# EasyEDA Pro project FKM3.epro, schematic Schematic1

## Sheets
1 P1: Board Name: AttendanceMonitor; Create Date: 2025-02-05; Page Name: P1; Project Name: fkm3; Schematic Name: Schematic1; Update Date: 2025-02-17; Company: EasyEDA.com; Drawn: EasyEDA; Page Size: A4; Part Number: JLCPCB-002; Reviewed: EasyEDA; Version: V0.1
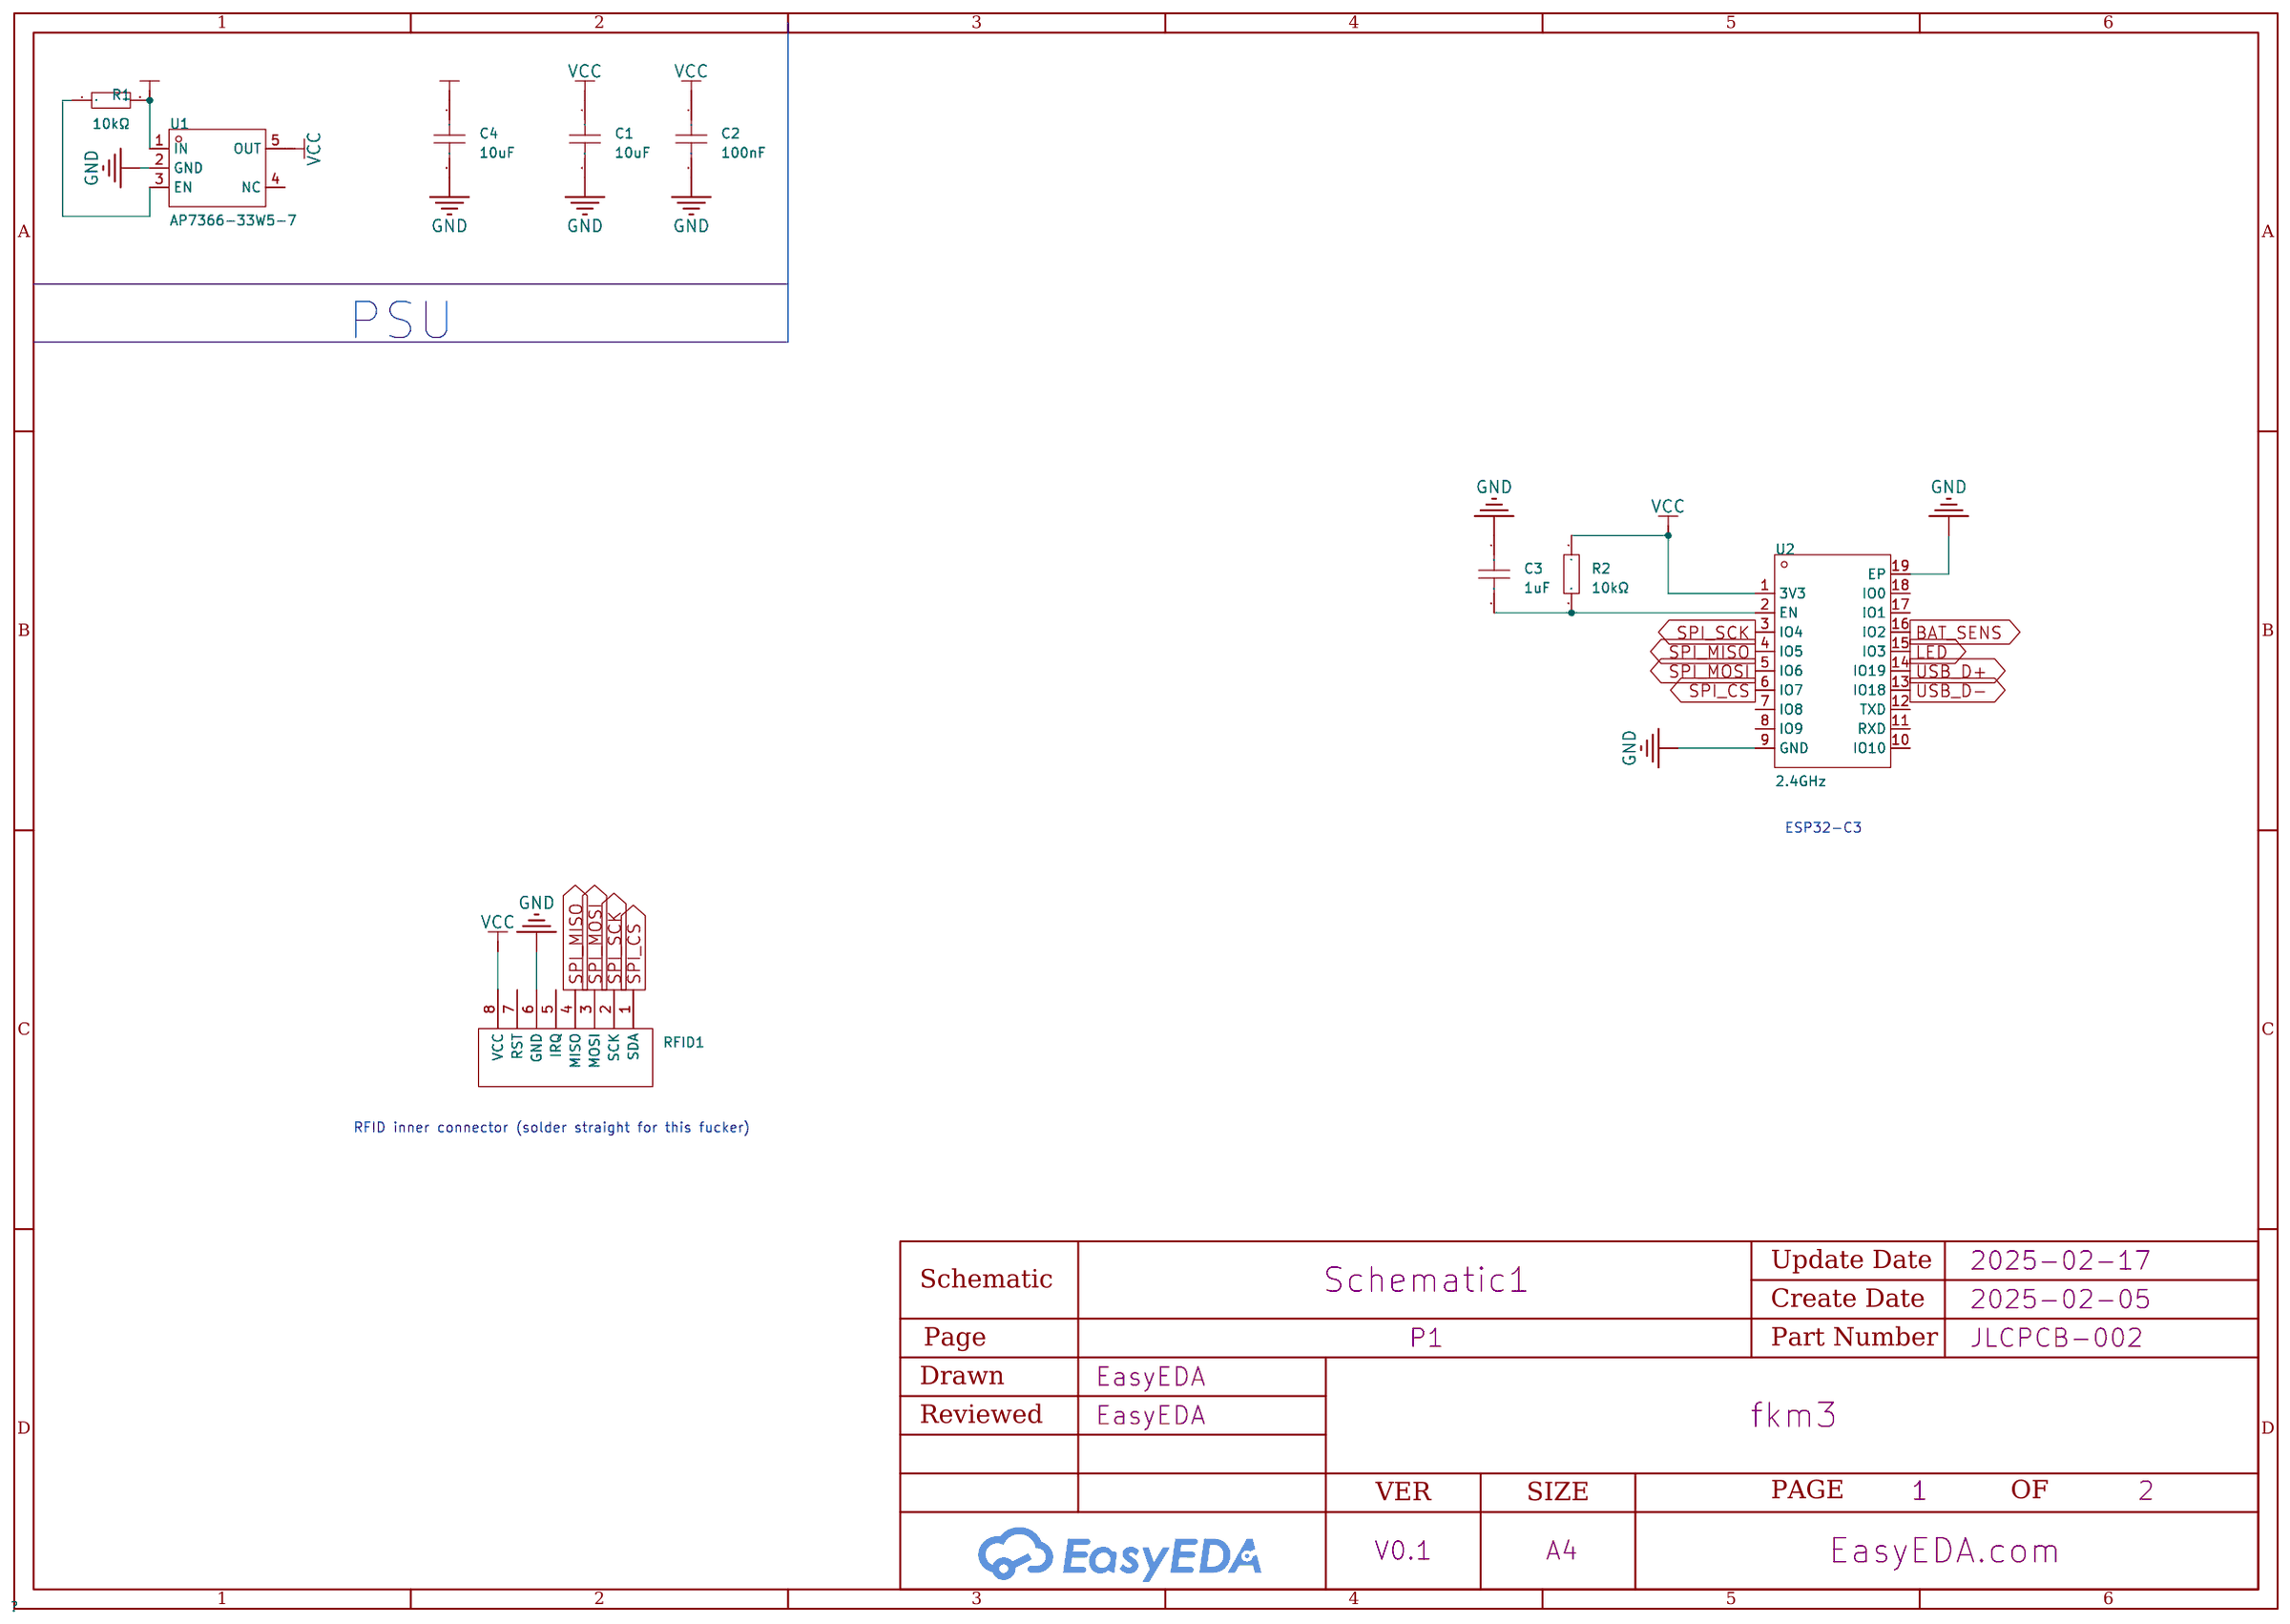
[diagram p0: P1]
2 P2: Page Name: P2; Update Date: 2025-02-07
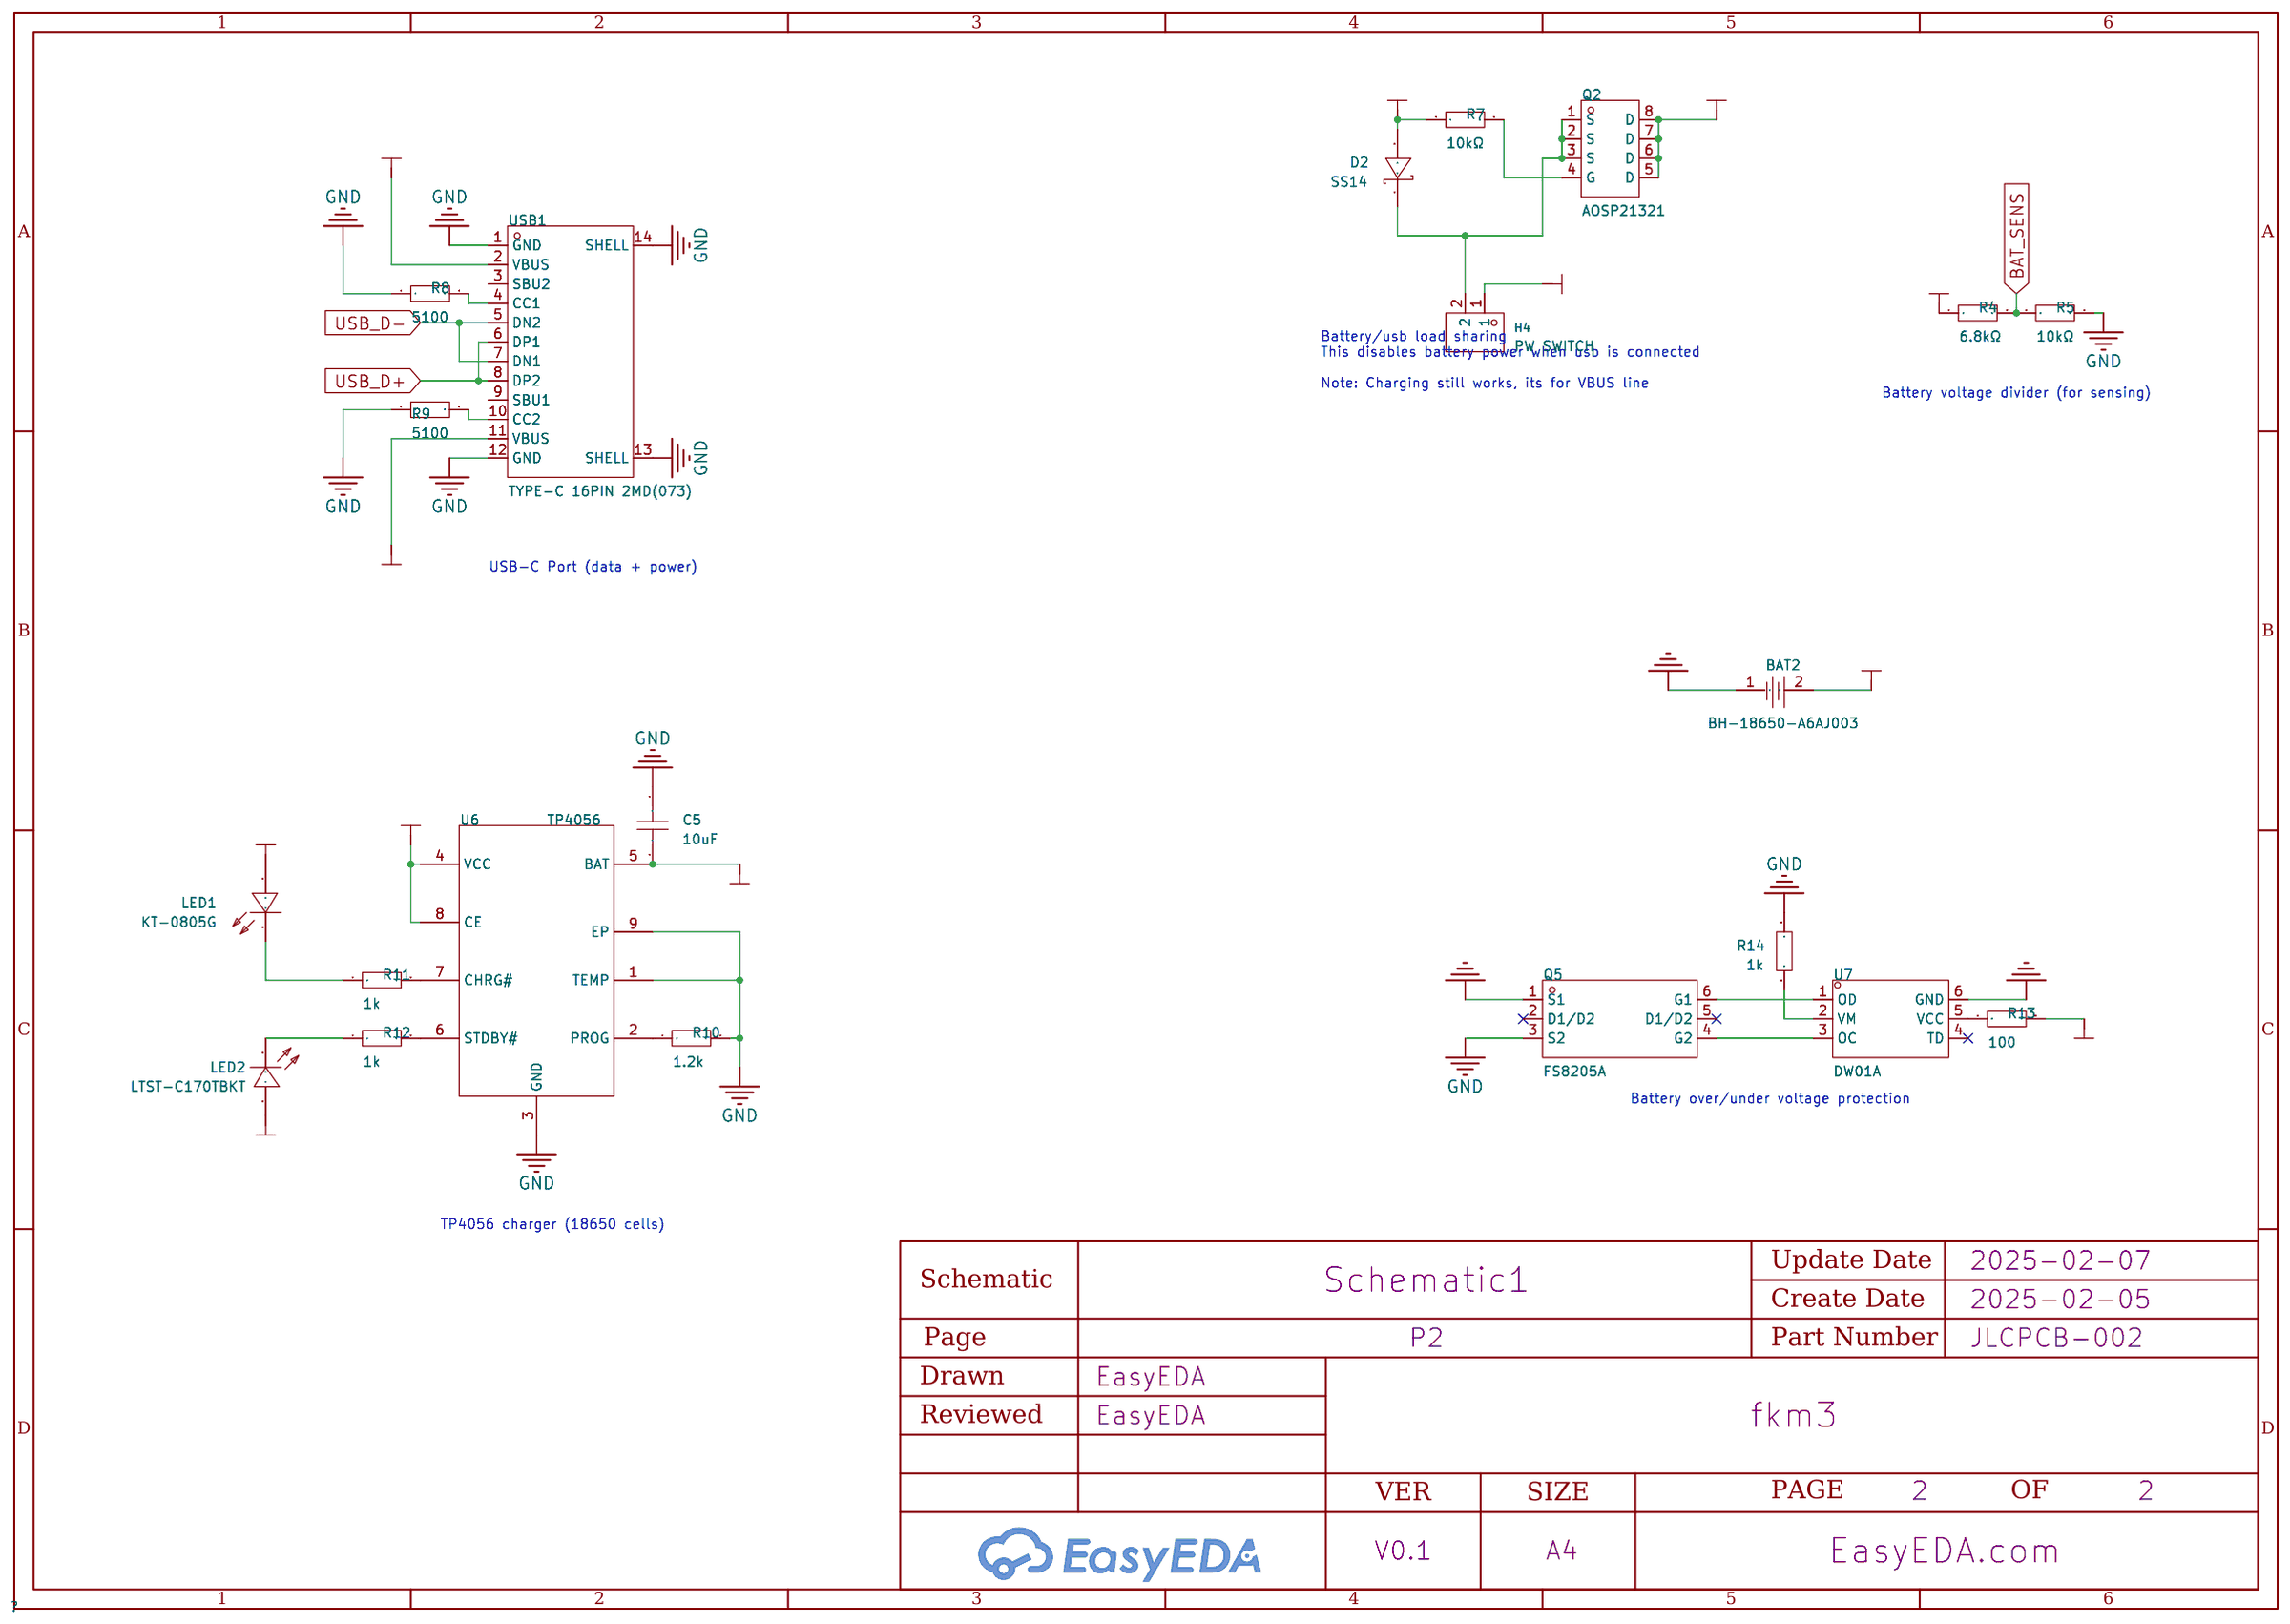
[diagram p1: P2]

## Parts
sheet P1
C1  10uF  [C0603]
C2  100nF  [C0603]
C3  1uF  [C0603]
C4  10uF  [C0603]
R1  10kΩ  [R0805]
R2  10kΩ  [R0805]
RFID1  -  [RFID-RC522-Board]
U1  AP7366-33W5-7  [SOT-25_L3.0-W1.6-P0.95-LS2.8-BL]
U2  2.4GHz  [BULETM-SMD_ESPRESSIF_ESP32-C3-WROOM-02-N4-4MB]
sheet P2
BAT2  BH-18650-A6AJ003  [BAT-TH_BH-18650-A5BJ003]
C5  10uF  [C0603]
D2  SS14  [SMA_L4.2-W2.6-LS5.3-RD]
H4  PW SWITCH  [HDR-TH_2P-P2.54-V-M]
LED1  KT-0805G  [LED0805-R-RD]
LED2  LTST-C170TBKT  [LED0805-RD_BLUE]
Q2  AOSP21321  [SOIC-8_L5.0-W4.0-P1.27-LS6.0-BL]
Q5  FS8205A  [SOT-23-6_L2.9-W1.6-P0.95-LS2.8-BR]
R4  6.8kΩ  [R0402]
R5  10kΩ  [R0805]
R7  10kΩ  [R0805]
R8  5100  [R0603]
R9  5100  [R0603]
R10  1.2k  [R0603]
R11  1k  [R0603]
R12  1k  [R0603]
R13  100  [R0603]
R14  1k  [R0603]
U6  TP4056  [ESOP-8_L4.9-W3.9-P1.27-LS6.0-BL-EP]
U7  DW01A  [SOT-23-6_L2.9-W1.6-P0.95-LS2.8-BL]
USB1  TYPE-C 16PIN 2MD(073)  [USB-C-SMD_TYPE-C-6PIN-2MD-073]

## Library data of the parts
C1 C4 = CL10A106MA8NRNC: Capacitance: Tolerance:±20% Tolerance:±20% Voltage Rated: Temperature Coefficient:; LCSC Part Name: 10uF ±20% 25V; Supplier Part: C96446; Manufacturer: SAMSUNG(三星); Supplier Footprint: 0603; JLCPCB Part Class: Basic Part; Datasheet: https://atta.szlcsc.com/upload/public/pdf/source/20160218/1457707763339.pdf; Supplier: LCSC; Tolerance: ±20%; Check: true
C2 = CC0603KRX7R9BB104: Capacitance: Tolerance:±10% Tolerance:±10% Voltage Rated: Temperature Coefficient:; LCSC Part Name: 100nF ±10% 50V; Supplier Part: C14663; Manufacturer: YAGEO(国巨); Supplier Footprint: 0603; JLCPCB Part Class: Basic Part; Datasheet: https://atta.szlcsc.com/upload/public/pdf/source/20180910/C282072_33301C7F631E79921B82A8DAC6BCC5B3.pdf; Supplier: LCSC; Tolerance: ±10%; Check: true
C3 = CL10A105KO8NNNC: Capacitance: Tolerance:±10% Tolerance:±10% Voltage Rated: Temperature Coefficient:; LCSC Part Name: 1uF ±10% 16V; Supplier Part: C1592; Manufacturer: SAMSUNG(三星); Supplier Footprint: 0603; JLCPCB Part Class: Extended Part; Datasheet: https://atta.szlcsc.com/upload/public/pdf/source/20220919/9FBE606BE0D9532D730F292EB26DC5BB.pdf; Supplier: LCSC; Tolerance: ±10%; Check: true
R1 R2 R5 R7 = SCR0805F10K: Type:Thick Film Resistors Resistance: Tolerance:±1% Tolerance:±1% Power(Watts): Overload Voltage (Max): Operating Temperature Range:-55℃~+155℃ Operating Temperature Range:-55℃~+155℃; LCSC Part Name: 厚膜电阻 10kΩ ±1% 125mW; Supplier Part: C3016734; Manufacturer: VO(翔胜); Supplier Footprint: 0805; JLCPCB Part Class: Extended Part; Datasheet: https://atta.szlcsc.com/upload/public/pdf/source/20220513/247AF9639BA21CF93567DC289CCC6A22.pdf; Supplier: LCSC; Type: Thick Film Resistors; Tolerance: ±1%; Operating Temperature Range: -55℃~+155℃; Check: true
RFID1 = RFID-RC522-Board
U1 = AP7366-33W5-7: Output Type:固定 Maximum Input Voltage:6V Output Voltage:3.3V Output Voltage:3.3V MAX Output Current:600mA Dropout Voltage:320mV@(600mA) standby current:80uA Operating Temperature:-40℃~+85℃@(Ta) Operating Temperature:-40℃~+85℃@(Ta) Output Polarity:Positive; Supplier Part: C526385; Manufacturer: DIODES(美台); Supplier Footprint: SOT-25; JLCPCB Part Class: Extended Part; Datasheet: https://atta.szlcsc.com/upload/public/pdf/source/20200515/C526385_78D268FE91AC13778CA0F1BF99E3B397.pdf; Supplier: LCSC; Output Type: 固定; Maximum Input Voltage: 6V; Output Voltage: 3.3V; MAX Output Current: 600mA; Dropout Voltage: 320mV@(600mA); standby current: 80uA; Operating Temperature: -40℃~+85℃@(Ta); Output Polarity: Positive electrode; Number of Outputs: 1
U2 = ESP32-C3-WROOM-02-N4_C2934560: Core Processor:ESP32-C3芯片 Support Interface:I2C；GPIO；SPI；JTAG；UART；USB；I2S Frequency:2.4GHz Output Power:20.5dBm Output Power:20.5dBm; LCSC Part Name: ESP32-C3-WROOM-02-N4; Supplier Part: C2934560; Manufacturer: ESPRESSIF(乐鑫); Manufacturer Part: ESP32-C3-WROOM-02-N4; Supplier Footprint: VFQFN-32-EP; JLCPCB Part Class: Extended Part; Datasheet: https://atta.szlcsc.com/upload/public/pdf/source/20220106/F07459EFFE1D7CBA94B4FB8A075146A6.pdf; Supplier: LCSC; Core Processor: ESP32-C3芯片; Support Interface: I2C；GPIO；SPI；JTAG；UART；USB；I2S; Output Power: 20.5dBm; Check: true
BAT2 = BH-18650-A6AJ003: Battery Type:- Contact Material:Stainless Steel Contact Plating:Nickel Operating Temperature Range:-25℃~+85℃ Operating Temperature Range:-25℃~+85℃; Supplier Part: C5371778; Manufacturer: MYOUNG(美阳); JLCPCB Part Class: Extended Part; Datasheet: https://atta.szlcsc.com/upload/public/pdf/source/20231218/F59CE24993943D35EA131B0A1D7CE933.pdf; Supplier: LCSC; Contact Material: Stainless Steel; Contact Plating: Nickel; Operating Temperature Range: -25℃~+85℃
C5 = CAP_0603: Supplier Footprint: 0603
D2 = SS14_C2480: Diode Configuration:Independent Type Forward Voltage (Vf@If):550mV@1A Reverse Voltage (Vr):40V Rectified Current:1A Reverse Leakage Current (Ir):300uA@40V; LCSC Part Name: 电压:40V 电流:1A; Supplier Part: C2480; Manufacturer: MDD(辰达半导体); Supplier Footprint: SMA(DO-214AC); JLCPCB Part Class: Basic Part; Datasheet: https://atta.szlcsc.com/upload/public/pdf/source/20240710/EF24798823EE33D63F154ED67BAC5E71.pdf; Supplier: LCSC; Diode Configuration: Independent Type; Forward Voltage (Vf@If): 550mV@1A; Reverse Voltage (Vr): 40V; Rectified Current: 1A; Reverse Leakage Current (Ir): 300uA@40V
H4 = PZ254V-11-02P: Pin Structure:1x2P Pitch:2.54mm Row Spacing:- Circluar Pins/Square Pins:Square Pins Mounting Type:Straight Number of Rows:Plugin Number of Pins:2P Current Rating (Max):- Voltage Rating (Max):- Length of Mating Pin:6mm Insulation Height:2.5mm Length of End; LCSC Part Name: 间距:2.54mm 1x2P 直插 方针; Supplier Part: C492401; Manufacturer: XFCN(兴飞); Supplier Footprint: 插件,P=2.54mm; JLCPCB Part Class: Extended Part; Datasheet: https://atta.szlcsc.com/upload/public/pdf/source/20200309/C492401_A812433581A9B211A7FFA413ADDFF0E5.pdf; Supplier: LCSC; Pin Structure: 1x2P; Pitch: 2.54mm; Circluar Pins/Square Pins: Square Pins; Mounting Type: Straight; Number of Rows: Plugin; Number of Pins: 2P; Length of Mating Pin: 6mm; Insulation Height: 2.5mm; Length of End Connection Pin: 3mm; Operating Temperature Range: -40℃~+105℃; Color: Black
LED1 = KT-0805G: Lamp Holder Type:- Emitted Color:Emerald Forward Voltage (VF):- Forward Voltage (VF):- Power Dissipation:- Forward Current:- Dominant Wavelength:- Dominant Wavelength:- Peak Wavelength:- Diode Configuration:- Lens Color:- Color Temperature:- Color Tempera; LCSC Part Name: 0805 翠绿 高亮; Supplier Part: C2297; Manufacturer: KENTO; Supplier Footprint: 0805; JLCPCB Part Class: Basic Part; Datasheet: https://atta.szlcsc.com/upload/public/pdf/source/20170209/1486607340485.pdf; Supplier: LCSC; Emitted Color: Emerald
LED2 = LTST-C170TBKT: Emitted Color:Blue Forward Voltage (VF):3.3V Forward Voltage (VF):3.3V Power Dissipation:76mW Forward Current:20mA Dominant Wavelength:465nm~475nm Dominant Wavelength:465nm~475nm Peak Wavelength:468nm Diode Configuration:- Lens Color:Colorless Transparent; LCSC Part Name: 蓝灯; Supplier Part: C98222; Manufacturer: LITEON(光宝); Supplier Footprint: 0805; JLCPCB Part Class: Extended Part; Datasheet: https://atta.szlcsc.com/upload/public/pdf/source/20171026/C98222_15089842934011059296.pdf; Supplier: LCSC; Emitted Color: Blue; Forward Voltage (VF): 3.3V; Power Dissipation: 76mW; Forward Current: 20mA; Dominant Wavelength: 465nm~475nm; Peak Wavelength: 468nm; Lens Color: Colorless Transparent Lens; Luminous Intensity: 104mcd; Viewing Angle: 130°; Operating Temperature: -20℃~+80℃
Q2 = AOSP21321: Type: Drain Source Voltage (Vdss): Continuous Drain Current (Id): Power Dissipation (Pd): Drain Source On Resistance (RDS(on)@Vgs,Id):14mΩ@10V,11A Gate Threshold Voltage (Vgs(th)@Id):2.3V@250uA Total Gate Charge (Qg@Vgs):34nC@10V Input Capacitance (Ciss@V; LCSC Part Name: P沟道 耐压:30V 电流:11A; Supplier Part: C560863; Manufacturer: AOS; Supplier Footprint: SOIC-8; JLCPCB Part Class: Extended Part; Datasheet: https://atta.szlcsc.com/upload/public/pdf/source/20200525/C560863_436EEFDDDA8B8415242A992860033725.pdf; Supplier: LCSC; Drain Source On Resistance (RDS(on)@Vgs,Id): 14mΩ@10V,11A; Gate Threshold Voltage (Vgs(th)@Id): 2.3V@250uA; Total Gate Charge (Qg@Vgs): 34nC@10V; Input Capacitance (Ciss@Vds): 1.18nF@15V; Reverse Transfer Capacitance (Crss@Vds): 155pF@15V; Operating Temperature: -55℃~+150℃@(Tj)
Q5 = FS8205A_C908265: Type:2 N-Channel Drain Source Voltage (Vdss): Continuous Drain Current (Id): Power Dissipation (Pd): Drain Source On Resistance (RDS(on)@Vgs,Id):18mΩ@4.5V,6A Gate Threshold Voltage (Vgs(th)@Id):1.2V@250uA Total Gate Charge (Qg@Vgs):11nC@4.5V Input Capacit; LCSC Part Name: 2个N沟道 耐压:20V 电流:6A; Supplier Part: C908265; Manufacturer: FUXINSEMI(富芯森美); Supplier Footprint: SOT-23-6L; JLCPCB Part Class: Extended Part; Datasheet: https://atta.szlcsc.com/upload/public/pdf/source/20201027/C908265_C6F1A5E0FB14735EF799FEF607A99450.pdf; Supplier: LCSC; Type: 2 N-Channel; Drain Source On Resistance (RDS(on)@Vgs,Id): 18mΩ@4.5V,6A; Gate Threshold Voltage (Vgs(th)@Id): 1.2V@250uA; Total Gate Charge (Qg@Vgs): 11nC@4.5V; Input Capacitance (Ciss@Vds): 800pF@8V; Reverse Transfer Capacitance (Crss@Vds): 125pF@8V; Operating Temperature: -55℃~+150℃@(Tj)
R4 = RMC04026.8K1%N: Resistance: Tolerance:±1% Tolerance:±1% Power(Watts):; LCSC Part Name: 6.8kΩ ±1% 62.5mW; Supplier Part: C325522; Manufacturer: Tyohm(幸亚电阻); Supplier Footprint: 0402; JLCPCB Part Class: Extended Part; Datasheet: https://atta.szlcsc.com/upload/public/pdf/source/20190115/C325956_D27151D492FFB3C9AB4A6F14FE01F30A.pdf; Supplier: LCSC; Tolerance: ±1%; Check: true
R8-R14 = Res_0603: Supplier Footprint: 0603
U6 = TP4056-42-ESOP8: Supplier Part: C16581; Manufacturer: TOPPOWER(南京拓微); Supplier Footprint: ESOP-8; JLCPCB Part Class: Extended Part; Datasheet: https://atta.szlcsc.com/upload/public/pdf/source/20190626/C16581_611BCF5D7CF554EAE465137A8F68DB3E.pdf; Supplier: LCSC
U7 = DW01A_C351410: Supplier Part: C351410; Manufacturer: PUOLOP(迪浦); Supplier Footprint: SOT-23-6L; JLCPCB Part Class: Extended Part; Datasheet: https://atta.szlcsc.com/upload/public/pdf/source/20190109/C351410_3E9B9491D1909DF24C48D1B9CD871392.pdf; Supplier: LCSC
USB1 = TYPE-C 16PIN 2MD(073): Connector Type:Type-C Standard:USB 3.1 Gender:Female Mounting Style:Horizontal attachment Number of Contacts:16P Number of Ports:1 Current Rating - Power (Max):5A Operating Temperature Range:-25℃~+85℃ Operating Temperature Range:-25℃~+85℃ Rated Voltage (M; LCSC Part Name: Type-C 母 卧贴; Supplier Part: C2765186; Manufacturer: SHOU HAN(首韩); Supplier Footprint: SMD; JLCPCB Part Class: Extended Part; Datasheet: https://atta.szlcsc.com/upload/public/pdf/source/20211123/39B17C16241EAC15C5E277BDA434118E.pdf; Supplier: LCSC; Connector Type: Type-C; Standard: USB 3.1; Gender: Female; Mounting Style: Horizontal attachment; Number of Contacts: 16P; Number of Ports: 1; Current Rating - Power (Max): 5A; Operating Temperature Range: -25℃~+85℃; Rated Voltage (Max): 5V; Connect-Disconnect Life: 5000 Cuts; Core Colour: Black

## Nets
GND: C1.2 C2.2 C3.1 C4.2 C5.1 Q5.3(S2) R5.2 R8.1 R9.1 R10.2 R14.1 RFID1.6(GND) U1.2(GND) U2.9(GND) U2.19(EP) U6.1(TEMP) U6.3(GND) U6.9(EP) USB1.1(GND) USB1.12(GND) USB1.13(SHELL) USB1.14(SHELL)
VBUS: C4.1 H4.1 R1.2 U1.1(IN)
VCC: C1.1 C2.1 R2.1 RFID1.8(VCC) U1.5(OUT) U2.1(3V3)
B+: BAT2.2 C5.2 Q2.5(D) Q2.6(D) Q2.7(D) Q2.8(D) R4.1 R13.2 U6.5(BAT)
B-: BAT2.1 Q5.1(S1) U7.6(GND)
BAT_SENS: R4.2 R5.1 U2.16(IO2)
LED: U2.15(IO3)
SPI_CS: RFID1.1(SDA) U2.6(IO7)
SPI_MISO: RFID1.4(MISO) U2.4(IO5)
SPI_MOSI: RFID1.3(MOSI) U2.5(IO6)
SPI_SCK: RFID1.2(SCK) U2.3(IO4)
USB_D+: U2.14(IO19) USB1.6(DP1) USB1.8(DP2)
USB_D-: U2.13(IO18) USB1.5(DN2) USB1.7(DN1)
VUSB: D2.2(A) LED1.1(A) LED2.2(A) R7.1 U6.4(VCC) U6.8(CE) USB1.2(VBUS) USB1.11(VBUS)
$1N405: C3.2 R2.2 U2.2(EN)
$1N1071: R1.1 U1.3(EN)
$2N1363: D2.1(K) H4.2 Q2.1(S) Q2.2(S) Q2.3(S)
$2N1368: Q2.4(G) R7.2
$2N1375: R14.2 U7.2(VM)
$2N1376: Q5.4(G2) U7.3(OC)
$2N1379: Q5.6(G1) U7.1(OD)
$2N1382: R13.1 U7.5(VCC)
$2N1388: R8.2 USB1.4(CC1)
$2N1391: R9.2 USB1.10(CC2)
$2N1394: R11.2 U6.7(CHRG#)
$2N1395: R12.2 U6.6(STDBY#)
$2N1399: R10.1 U6.2(PROG)
$2N1401: LED2.1(K) R12.1
$2N1402: LED1.2(K) R11.1

Not connected (* = marked no-connect by the designer): Q5 2(D1/D2)* 5(D1/D2)*; RFID1 5(IRQ) 7(RST); U1 4(NC); U2 7(IO8) 8(IO9) 10(IO10) 11(RXD) 12(TXD) 17(IO1) 18(IO0); U7 4(TD)*; USB1 3(SBU2) 9(SBU1)

## Notes on the sheets
sheet 1
- PSU
- ESP32-C3
- RFID inner connector (solder straight for this fucker)
sheet 2
- Battery/usb load sharing
  This disables battery power when usb is connected
  Note: Charging still works, its for VBUS line
- Battery voltage divider (for sensing)
- USB-C Port (data + power)
- Battery over/under voltage protection
- TP4056 charger (18650 cells)
